# EasyEDA Pro project ProPrj_AI台灯_模块版_2026-09-22.epro, board PCB1
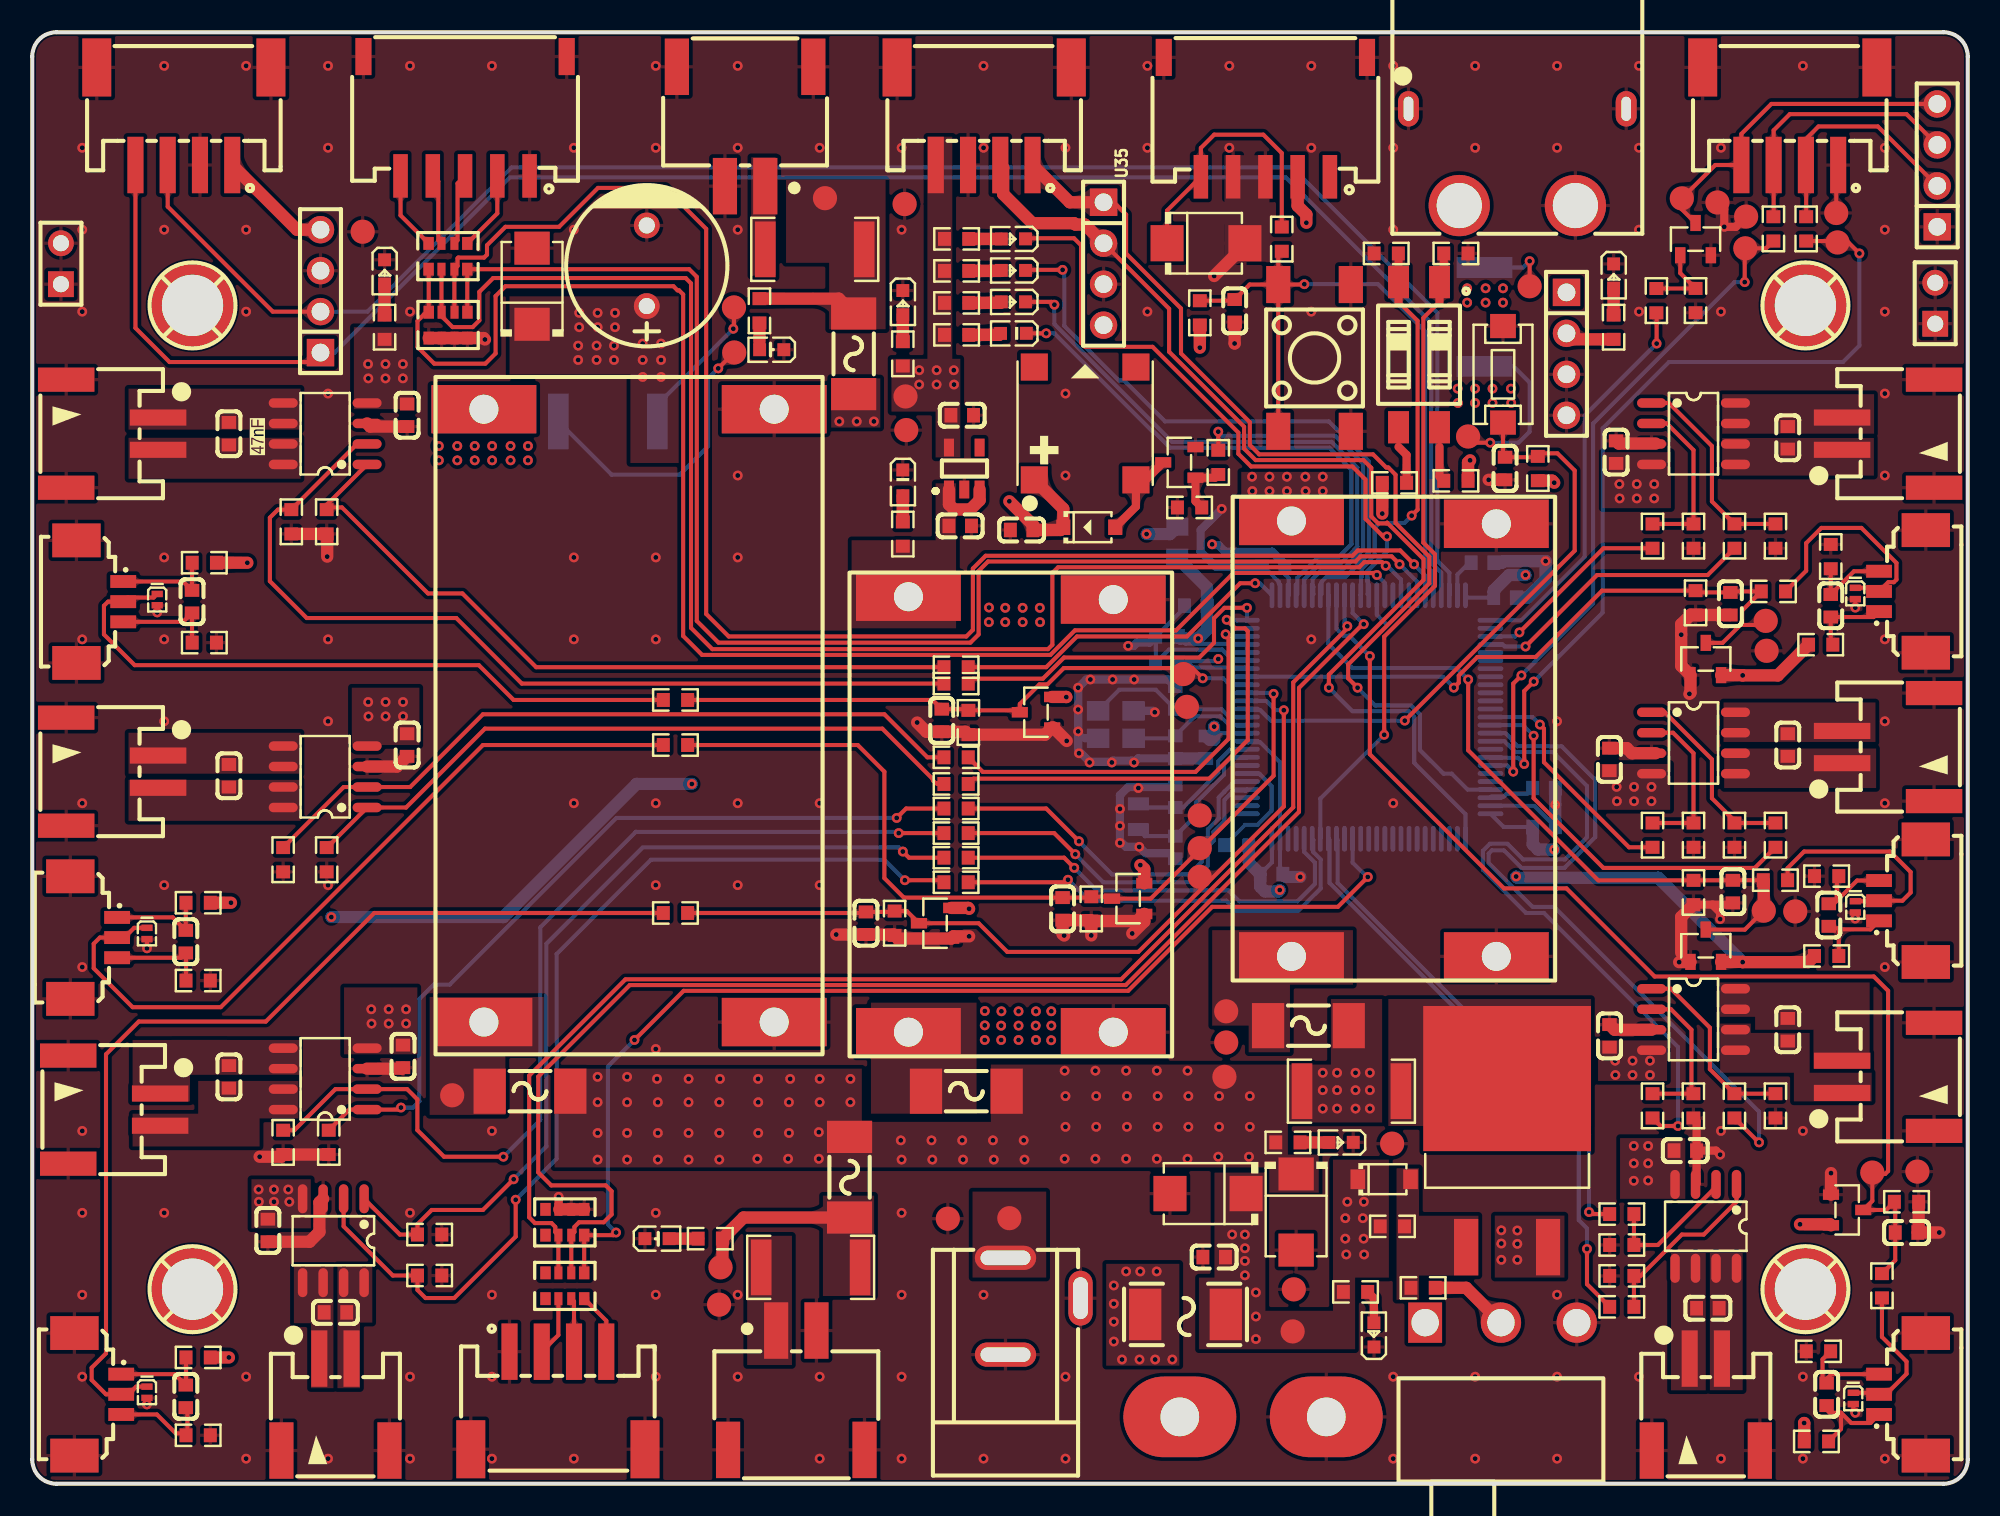
[diagram p5: board, top side]
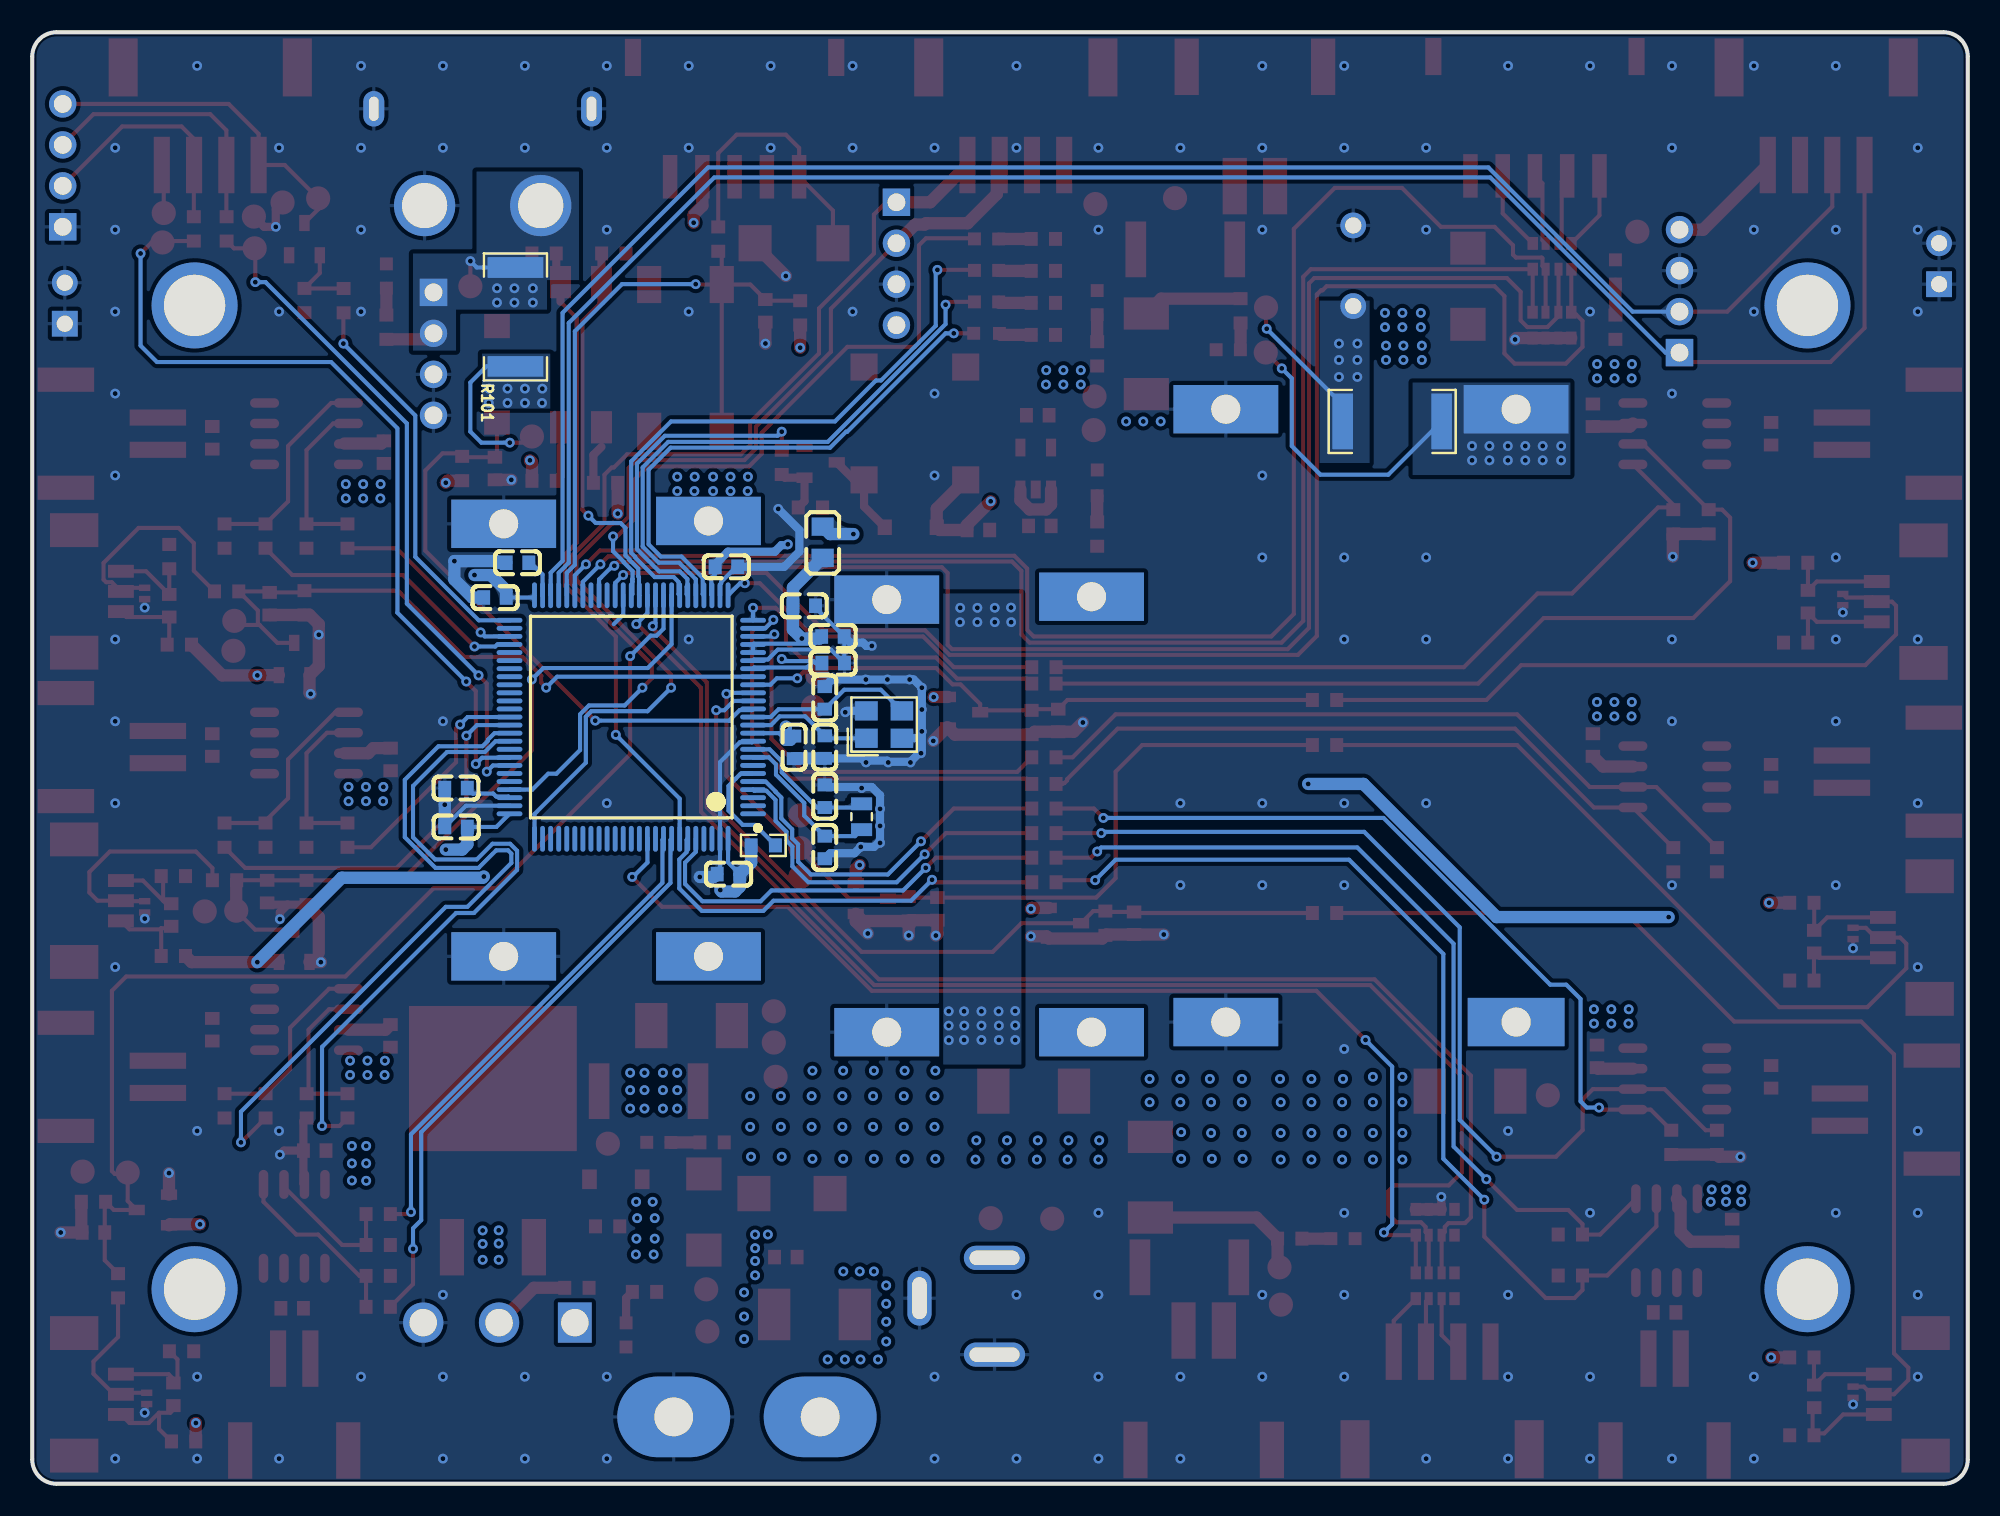
[diagram p6: board, bottom side, seen from below]

Outline 120 x 90 mm; copper layers: Top Layer, GND, VCC, Bottom Layer. Coordinates in mm from the lower left corner of the outline.
Outline path: 0,88.5 0,1.5 arc(0.44,0.44) 1.5,0 118.5,0 arc(119.56,0.44) 120,1.5 120,88.5 arc(119.56,89.56) 118.5,90 1.5,90 arc(0.44,89.56) 0,88.5
Stack: Top Layer 0.035mm Outer layer thickness 1oz / Dielectric1 0.2104mm 7628 RC49% 8.6mil / GND 0.0152mm Inner layer thickness / Dielectric2 1.065mm 1.1mm H/HOZ Copper / VCC 0.0152mm Inner layer thickness / Dielectric3 0.2104mm 7628 RC49% 8.6mil / Bottom Layer 0.035mm Outer layer thickness 1oz

## Design rules (mm)
spacing copperThickness1oz (default): track to track 0.102, other pairs 0.152 to 0.3
spacing copperThickness2oz: track to track 0.203, other pairs 0.152 to 0.3
track width copperThickness1oz (default): min 0.127, default 0.254, max 2.54
track width copperThickness2oz: min 0.203, default 0.254, max 2.54
differential pair differentialPair (default): width min 0.127, default 0.254, max 2.54; gap min 0.152, default 0.152
net 12V_MOTOR uses copperRegion
net GND uses copperRegion

## Placement (name value [footprint] x y rotation side)
BOOT1  DSIC02LS-P  [SW-SMD_4P-L5.1-W6.1-P2.54-LS9.8]  85.98 70.01 180 top
BUZZER1  2.7kHz  [BUZ-SMD_4P-L7.5-W7.5-P7.59-TL]  65.28 65.74 90 top
C1  470uF  [CAP-TH_BD10.0-P5.00-D1.0-FD-H16.0]  38.1 75.52 90 top
C2  100nF  [C0603]  61.34 59.14 0 top
C3  15pF  [C0603]  70.87 39.45 90 bottom
C4  15pF  [C0603]  70.87 42.63 270 bottom
C5  100nF  [C0603]  76.96 56.85 180 bottom
C6  100nF  [C0603]  70.34 50.88 180 bottom
C7  100nF  [C0603]  72.77 45.66 270 bottom
C8  100nF  [C0603]  76.84 37.8 0 bottom
C9  100nF  [C0603]  91.31 54.95 0 bottom
C10  100nF  [C0603]  93.73 40.72 0 bottom
C11  100nF  [C0603]  70.36 52.53 0 bottom
C12  1uF  [C0603]  72.14 54.44 0 bottom
C13  2.2uF  [C0603]  89.92 57.11 180 bottom
C14  2.2uF  [C0603]  93.73 43.14 180 bottom
C15  100nF  [C0603]  91.31 62.95 270 top
C16  15pF  [C0603]  70.87 48.72 270 bottom
C17  100nF  [C0603]  73.28 14.05 0 top
C19  15pF  [C0603]  70.87 45.68 90 bottom
C20  100nF  [C0603]  23.24 66.25 90 top
C21  100nF  [C0603]  9.91 54.69 90 top
C22  100nF  [C0603]  56.39 47.33 90 top
C23  100nF  [C0603]  23.24 45.8 90 top
C24  100nF  [C0603]  9.52 33.61 90 top
C25  100nF  [C0603]  63.88 35.64 90 top
C26  47nF  [C0603]  12.19 65.11 270 top
C27  100nF  [C0603]  74.55 72.73 90 top
C28  47nF  [C0603]  12.19 43.9 90 top
C29  100nF  [C0603]  98.2 63.97 270 top
C30  47nF  [C0603]  108.84 64.85 90 top
C31  100nF  [C0603]  97.78 44.91 270 top
C32  47nF  [C0603]  108.84 45.8 90 top
C33  100nF  [C0603]  22.99 26.5 90 top
C34  47nF  [C0603]  12.19 25.23 270 top
C35  100nF  [C0603]  97.79 27.77 270 top
C36  47nF  [C0603]  108.84 28.15 90 top
C37  100nF  [C0603]  102.49 20.66 180 top
C38  47nF  [C0603]  103.89 10.88 0 top
C39  100nF  [C0603]  14.61 15.71 90 top
C40  47nF  [C0603]  18.8 10.62 0 top
C41  100nF  [C0603]  9.52 5.42 90 top
C42  100nF  [C0603]  51.69 34.75 90 top
C43  100nF  [C0603]  111.51 54.44 270 top
C44  100nF  [C0603]  105.28 54.57 90 top
C45  100nF  [C0603]  111.38 35.26 270 top
C46  100nF  [C0603]  105.44 36.72 90 top
C47  100nF  [C0603]  111.25 5.54 270 top
C48  100nF  [C0603]  116.21 15.58 180 top
C53  1uF  [C0603]  57.53 59.39 180 top
C54  1uF  [C0603]  57.66 66.25 180 top
CN1  PH2.0mm-2P-WT  [CONN-SMD_2P-P2.00_PH2.0-2PWT]  115.06 25.23 90 top
CN2  PH2.0mm-2P-WT  [CONN-SMD_2P-P2.00_PH2.0-2PWT]  4.95 44.15 270 top
CN3  PH2.0mm-2P-WT  [CONN-SMD_2P-P2.00_PH2.0-2PWT]  5.08 23.2 270 top
CN4  PH2.0mm-2P-WT  [CONN-SMD_2P-P2.00_PH2.0-2PWT]  103.76 4.91 0 top
CN7  AFC20-S05ACC-00  [CONN-SMD_AFC20-S05ACC-00]  26.83 84.79 0 top
CN9  PH2.0mm-2P-WT  [CONN-SMD_2P-P2.00_PH2.0-2PWT]  4.95 65.11 270 top
CN10  PH2.0mm-2P-WT  [CONN-SMD_2P-P2.00_PH2.0-2PWT]  115.06 65.11 90 top
CN11  PH2.0mm-2P-WT  [CONN-SMD_2P-P2.00_PH2.0-2PWT]  115.06 45.68 90 top
CN12  PH2.0mm-2P-WT  [CONN-SMD_2P-P2.00_PH2.0-2PWT]  18.8 4.91 0 top
CN15  AFC20-S05ACC-00  [CONN-SMD_AFC20-S05ACC-00]  76.45 84.74 0 top
D1  SMBJ28A  [SMB_L4.6-W3.6-LS5.3-RD]  72.9 17.99 180 top
D6  BZT52C12  [SOD-123_L2.7-W1.6-LS3.7-RD]  83.82 18.88 0 top
D7  SMBJ28A  [SMB_L4.6-W3.6-LS5.3-RD]  78.36 16.85 270 top
D12  BAT54S  [SOT-23-3_L2.9-W1.3-P1.90-LS2.4-BR]  67.94 36.28 0 top
D13  BAT54S  [SOT-23-3_L2.9-W1.3-P1.90-LS2.4-BR]  62.23 47.84 0 top
D14  SMBJ15A  [SMB_L4.6-W3.6-LS5.3-RD]  30.99 74.25 90 top
D15  BAT54S  [SOT-23-3_L2.9-W1.3-P1.90-LS2.4-BR]  55.97 34.75 0 top
D16  BAT54S  [SOT-23-3_L2.9-W1.3-P1.90-LS2.4-BR]  103.76 33.36 270 top
D17  BAT54S  [SOT-23-3_L2.9-W1.3-P1.90-LS2.4-BR]  103.76 51.14 270 top
D18  BAT54S  [SOT-23-3_L2.9-W1.3-P1.90-LS2.4-BR]  112.52 16.97 180 top
D19  SMBJ5.0A  [SMB_L4.6-W3.6-LS5.4-RD]  72.77 76.92 0 top
D20  1N4148W  [SOD-123_L2.7-W1.6-LS3.7-FD]  65.53 59.31 180 top
D21  PESD3V3U1UL  [SOD-882_L1.0-W0.6-RD]  7.11 34.12 270 top
D22  PESD3V3U1UL  [SOD-882_L1.0-W0.6-RD]  7.75 54.82 270 top
D23  PESD3V3U1UL  [SOD-882_L1.0-W0.6-RD]  7.11 5.67 270 top
D24  PESD3V3U1UL  [SOD-882_L1.0-W0.6-RD]  112.9 5.29 270 top
D25  PESD3V3U1UL  [SOD-882_L1.0-W0.6-RD]  113.03 35.77 270 top
D26  PESD3V3U1UL  [SOD-882_L1.0-W0.6-RD]  113.03 55.2 270 top
DC1  DC-005-A200  [DC-IN-TH_DC-005-A200]  62.67 11.01 90 top
F5  AF2-6.30V125TM  [FUSE-SMD_L6.1-W2.5-1]  50.93 70.06 90 top
F6  AF2-6.30V125TM  [FUSE-SMD_L6.1-W2.5-1]  50.67 19.01 270 top
F7  AF2-6.30V125TM  [FUSE-SMD_L6.1-W2.5-1]  79.12 28.41 180 top
F8  AF2-6.30V125TM  [FUSE-SMD_L6.1-W2.5-1]  30.86 24.34 180 top
F9  AF2-6.30V125TM  [FUSE-SMD_L6.1-W2.5-1]  57.91 24.34 180 top
H1  LAIL-PZ2.54-2P-L  [CONN-TH_LAIL-PZ2.54-2P-L]  1.78 75.65 90 top
H2  LAIL-PZ2.54-2P-L  [CONN-TH_LAIL-PZ2.54-2P-L]  117.98 73.2 90 top
L1  CBW201209U601T  [L0805]  70.99 58.38 90 bottom
LED1  XL-1608SURC-06  [LED0603-RD_RED]  60.83 77.19 180 top
LED2  LTST-C190KSKT  [LED0603-RD]  60.83 75.23 180 top
LED3  NCD0603Y2  [LED0603-RD]  60.83 73.28 180 top
LED7  XL-1608SURC-06  [LED0603-RD_RED]  81.15 21.17 180 top
LED8  GL0603UW01  [LED0603-R-RD]  45.85 70.31 180 top
LED9  GL0603UW01  [LED0603-R-RD]  38.74 15.2 0 top
LED10  LTST-C190KSKT  [LED0603-RD]  21.84 75.14 270 top
LED11  NCD0603Y2  [LED0603-RD]  98.04 74.89 270 top
LED12  LTST-C190KSKT  [LED0603-RD]  53.97 73.24 270 top
LED13  XL-1608SURC-06  [LED0603-RD_RED]  83.19 9.23 90 top
Q2  SQM120P06-07L_GE3  [TO-263-2_L10.1-W9.1-P5.08-LS15.2-TL-1]  91.44 19.9 90 top
Q10  2N7002  [SOT-23-3_L2.9-W1.3-P1.90-LS2.4-BR]  103.12 77.17 270 top
Q11  SS8050  [SOT-23-3_L2.9-W1.3-P1.90-LS2.4-BR]  71.12 63.33 0 top
R12  100kΩ  [R0603]  84.33 15.96 0 top
R13  10kΩ  [R0603]  86.23 12.15 0 top
R19  100R  [R0603]  84.46 62.06 180 top
R20  100R  [R0603]  88.26 62.19 0 top
R21  10K  [R0603]  83.95 76.28 0 top
R22  10K  [R0603]  88.26 76.28 180 top
R23  10K  [R0603]  93.34 62.95 90 top
R24  0Ω  [R0603]  74.68 39.58 180 bottom
R25  100Ω  [R0603]  57.28 50.63 180 top
R26  10kΩ  [R0603]  18.25 59.65 270 top
R27  100Ω  [R0603]  57.28 49.61 180 top
R28  10kΩ  [R0603]  16.06 59.65 270 top
R29  1kΩ  [R0603]  10.67 57.11 0 top
R30  1kΩ  [R0603]  10.67 52.15 180 top
R31  1kΩ  [R0603]  39.88 48.6 180 top
R32  100kΩ  [R0603]  58.04 47.2 90 top
R33  100Ω  [R0603]  57.28 45.04 180 top
R34  10kΩ  [R0603]  15.55 38.69 270 top
R35  100Ω  [R0603]  57.28 43.39 180 top
R36  10kΩ  [R0603]  18.25 38.69 270 top
R37  1kΩ  [R0603]  10.29 36.03 0 top
R38  1kΩ  [R0603]  10.29 31.2 180 top
R39  1kΩ  [R0603]  39.88 45.8 180 top
R40  100kΩ  [R0603]  65.66 35.64 90 top
R41  100Ω  [R0603]  100.7 73.36 90 top
R42  100kΩ  [R0603]  103.12 73.36 90 top
R43  10kΩ  [R0603]  72.39 72.6 270 top
R44  12kΩ  [R0603]  77.85 21.17 0 top
R45  12kΩ  [R0603]  45.09 72.73 270 top
R46  12kΩ  [R0603]  42.04 15.2 180 top
R47  5.1kΩ  [R0603]  21.84 71.71 90 top
R48  100Ω  [R0603]  100.46 58.76 90 top
R49  10kΩ  [R0603]  103 58.76 270 top
R50  100Ω  [R0603]  105.54 58.76 90 top
R51  10kΩ  [R0603]  108.08 58.76 270 top
R52  100Ω  [R0603]  100.46 40.22 90 top
R53  10kΩ  [R0603]  103 40.22 270 top
R54  100Ω  [R0603]  108.08 40.22 90 top
R55  10kΩ  [R0603]  105.54 40.22 270 top
R56  100Ω  [R0603]  57.28 41.87 180 top
R57  10kΩ  [R0603]  18.38 21.17 270 top
R58  100Ω  [R0603]  57.28 40.34 180 top
R59  10kΩ  [R0603]  15.55 21.17 270 top
R60  100Ω  [R0603]  100.46 23.43 90 top
R61  10kΩ  [R0603]  102.99 23.43 270 top
R62  100Ω  [R0603]  105.53 23.43 90 top
R63  10kΩ  [R0603]  108.08 23.43 270 top
R64  100Ω  [R0603]  98.55 16.72 0 top
R65  10kΩ  [R0603]  98.55 14.8 180 top
R66  100Ω  [R0603]  98.55 10.97 0 top
R67  10kΩ  [R0603]  98.55 12.89 180 top
R68  100Ω  [R0603]  57.28 37.3 180 top
R69  10kΩ  [R0603]  24.64 12.91 0 top
R70  100Ω  [R0603]  57.28 38.82 180 top
R71  10kΩ  [R0603]  24.64 15.45 0 top
R72  1kΩ  [R0603]  10.29 7.83 0 top
R73  1kΩ  [R0603]  10.29 3 180 top
R74  1kΩ  [R0603]  39.88 35.39 180 top
R75  100kΩ  [R0603]  53.47 34.75 90 top
R76  1kΩ  [R0603]  110.88 52.03 180 top
R77  1kΩ  [R0603]  111.51 57.49 270 top
R78  1kΩ  [R0603]  107.95 55.33 0 top
R79  100kΩ  [R0603]  103.12 54.62 90 top
R80  1kΩ  [R0603]  111.25 32.72 180 top
R81  1kΩ  [R0603]  111.25 37.68 0 top
R82  1kΩ  [R0603]  108.08 37.42 0 top
R83  100kΩ  [R0603]  103 36.66 90 top
R84  1kΩ  [R0603]  110.62 2.62 180 top
R85  1kΩ  [R0603]  110.74 8.21 0 top
R86  1kΩ  [R0603]  114.68 12.28 270 top
R87  100kΩ  [R0603]  116.21 17.48 180 top
R88  4.7kΩ  [R0603]  98.04 71.71 90 top
R89  1.5kΩ  [R0603]  53.97 58.89 90 top
R90  1kΩ  [R0603]  53.97 70.06 90 top
R91  12kΩ  [R0603]  82.04 11.9 0 top
R92  1kΩ  [R0603]  77.47 77.17 270 top
R93  47Ω  [R0603]  109.98 77.81 90 top
R94  47Ω  [R0603]  107.95 77.81 90 top
R95  1kΩ  [R0603]  57.31 77.19 0 top
R96  1kΩ  [R0603]  57.31 75.2 0 top
R97  1kΩ  [R0603]  57.31 73.22 0 top
R98  1kΩ  [R0603]  57.31 71.24 0 top
R99  470Ω  [R0603]  73.53 63.33 270 top
R100  100kΩ  [R0603]  71.75 60.54 0 top
R101  10mΩ  [R2512]  90.04 72.35 90 bottom
R102  10mΩ  [R2512]  35.69 65.87 0 bottom
R103  5mΩ  [R2512]  81.79 24.34 180 top
R104  10mΩ  [R2512]  48.51 76.54 180 top
R105  10mΩ  [R2512]  48.26 13.42 180 top
RN1  100Ω  [RES-ARRAY-SMD_0603-8P-L3.2-W1.6-BL]  25.77 76.11 0 top
RN2  100Ω  [RES-ARRAY-SMD_0603-8P-L3.2-W1.6-BL]  33.02 12.28 180 top
RN3  10kΩ  [RES-ARRAY-SMD_0603-8P-L3.2-W1.6-BL]  25.78 71.84 0 top
RN4  10kΩ  [RES-ARRAY-SMD_0603-8P-L3.2-W1.6-BL]  33.02 16.21 180 top
RST1  EVQPE104K  [SW-SMD_L6.0-W3.5-LS7.2]  91.19 68.79 90 top
SW1  KH-6X6X5H-STM  [SW-SMD_4P-L6.0-W6.0-P4.50-LS9.0_H5.0]  79.5 69.81 90 top
TP1  -  [M3螺丝]  10 12 0 top
TP2  -  [M3螺丝]  110 12 0 top
TP3  -  [M3螺丝]  10 73 0 top
TP4  -  [M3螺丝]  110 73 0 top
TP5  -  [Test-Point-0.5mm]  60.58 16.47 0 top
TP6  -  [Test-Point-0.5mm]  78.14 9.44 0 top
TP7  -  [Test-Point-0.5mm]  73.91 25.23 0 top
TP8  -  [Test-Point-0.5mm]  49.15 79.71 0 top
TP9  -  [Test-Point-0.5mm]  42.67 13.42 0 top
TP10  -  [Test-Point-0.5mm]  26.03 24.09 0 top
TP11  -  [Test-Point-0.5mm]  89.02 64.94 0 top
TP12  -  [Test-Point-0.5mm]  74.03 29.29 0 top
TP13  -  [Test-Point-0.5mm]  92.84 74.25 0 top
TP14  -  [Test-Point-0.5mm]  43.52 70.14 0 top
TP15  -  [Test-Point-0.5mm]  54.14 67.42 0 top
TP16  -  [Test-Point-0.5mm]  42.58 11.1 0 top
TP17  -  [Test-Point-0.5mm]  20.49 77.63 0 top
TP18  -  [Test-Point-0.5mm]  43.51 72.94 0 top
TP20  -  [Test-Point-0.5mm]  54.09 79.35 0 top
TP21  -  [Test-Point-0.5mm]  78.22 12.05 0 top
TP22  -  [Test-Point-0.5mm]  84.31 21.09 0 top
TP23  -  [Test-Point-0.5mm]  74.03 27.36 0 top
TP24  -  [Test-Point-0.5mm]  71.37 50.2 0 top
TP25  -  [Test-Point-0.5mm]  72.38 39.41 0 top
TP26  -  [Test-Point-0.5mm]  72.38 37.63 0 top
TP27  -  [Test-Point-0.5mm]  107.47 53.5 0 top
TP28  -  [Test-Point-0.5mm]  107.35 35.53 0 top
TP29  -  [Test-Point-0.5mm]  114.09 19.29 0 top
TP30  -  [Test-Point-0.5mm]  111.93 76.97 0 top
TP31  -  [Test-Point-0.5mm]  106.21 76.6 0 top
TP32  -  [Test-Point-0.5mm]  102.27 79.7 0 top
TP33  -  [Test-Point-0.5mm]  54.19 65.33 0 top
TP35  -  [Test-Point-0.5mm]  72.38 41.44 0 top
TP36  -  [Test-Point-0.5mm]  109.31 35.49 0 top
TP38  -  [Test-Point-0.5mm]  107.53 51.65 0 top
TP39  -  [Test-Point-0.5mm]  71.59 48.17 0 top
TP40  -  [Test-Point-0.5mm]  111.85 78.79 0 top
TP41  -  [Test-Point-0.5mm]  104.48 79.44 0 top
TP42  -  [Test-Point-0.5mm]  106.26 78.57 0 top
TP43  -  [Test-Point-0.5mm]  116.88 19.35 0 top
TP44  -  [Test-Point-0.5mm]  56.76 16.43 0 top
U1  SS-12D06-G050  [SW-TH_3P-P4.70_SS-12D06-G050]  91.06 9.99 0 top
U2  AF2-15.0V065TM  [F2410]  71.5 10.5 0 top
U3  PSC-1608U52GC-G4  [LED0603-RD_GREEN]  53.97 62.06 270 top
U4  PSC-1608U52GC-G4  [LED0603-RD_GREEN]  60.83 71.33 180 top
U5  A2001WR-S-04PD01  [CONN-SMD_A2001WR-S-04PD01]  108.97 84.79 0 top
U6  XT60PW-F  [TH_2P-XT60PW-F]  92.07 82.25 0 top
U7  STM32F407VGT6  [LQFP-100_L14.0-W14.0-P0.50-LS16.0-BL]  82.86 47.54 90 bottom
U8  RZ7899-MS  [SOIC-8_L4.9-W3.9-P1.27-LS6.0-BL]  18.16 65.11 90 top
U9  RZ7899-MS  [SOIC-8_L4.9-W3.9-P1.27-LS6.0-BL]  18.16 43.84 90 top
U10  A2001WR-S-04PD01  [CONN-SMD_A2001WR-S-04PD01]  59.02 84.79 0 top
U11  -  [电源焊盘封装]  71.15 4.15 0 top
U12  -  [电源焊盘封装]  80.23 4.15 0 top
U13  RZ7899-MS  [SOIC-8_L4.9-W3.9-P1.27-LS6.0-BL]  103 65.11 270 top
U14  RZ7899-MS  [SOIC-8_L4.9-W3.9-P1.27-LS6.0-BL]  103 45.93 270 top
U15  RZ7899-MS  [SOIC-8_L4.9-W3.9-P1.27-LS6.0-BL]  18.16 25.1 90 top
U16  RZ7899-MS  [SOIC-8_L4.9-W3.9-P1.27-LS6.0-BL]  103 28.79 270 top
U17  RZ7899-MS  [SOIC-8_L4.9-W3.9-P1.27-LS6.0-BL]  103.76 15.96 180 top
U18  RZ7899-MS  [SOIC-8_L4.9-W3.9-P1.27-LS6.0-BL]  18.67 15.07 180 top
U19  -  [24V降压模块封装]  74.42 31.2 90 top
U20  -  [24V降压模块封装]  50.67 26.5 90 top
U21  -  [大功率24V降压模块封装]  25 26.63 90 top
U22  XDWF-0125WT-03P  [CONN-SMD_3P-P1.25_XDWF-0125WT-03P]  4.19 54.69 270 top
U23  AP2112K-3.3TRG1  [SOT-25-5_L2.9-W1.6-P0.95-LS2.8-BL]  57.78 62.95 0 top
U24  XDWF-0125WT-03P  [CONN-SMD_3P-P1.25_XDWF-0125WT-03P]  3.81 33.87 270 top
U25  XDWF-0125WT-03P  [CONN-SMD_3P-P1.25_XDWF-0125WT-03P]  4.06 5.54 270 top
U26  XDWF-0125WT-03P  [CONN-SMD_3P-P1.25_XDWF-0125WT-03P]  115.95 55.33 90 top
U27  XDWF-0125WT-03P  [CONN-SMD_3P-P1.25_XDWF-0125WT-03P]  115.95 36.15 90 top
U28  XDWF-0125WT-03P  [CONN-SMD_3P-P1.25_XDWF-0125WT-03P]  115.95 5.54 90 top
U29  A2001WR-S-04PD01  [CONN-SMD_A2001WR-S-04PD01]  32.59 5.16 180 top
U30  A2001WR-S-04PD01  [CONN-SMD_A2001WR-S-04PD01]  9.4 84.79 0 top
U31  BX-XH2.54-2PWT  [CONN-SMD_2P-P2.50_BX-XH2.54-2PWT]  44.2 84.16 180 top
U32  BX-XH2.54-2PWT  [CONN-SMD_2P-P2.50_BX-XH2.54-2PWT]  47.37 5.8 0 top
U33  HX PZ2.54-1x4P ZZ  [HDR-TH_4P-P2.54-V-M]  17.87 73.95 90 top
U34  HX PZ2.54-1x4P ZZ  [HDR-TH_4P-P2.54-V-M]  95.12 70.06 270 top
U35  HX PZ2.54-1x4P ZZ  [HDR-TH_4P-P2.54-V-M]  66.42 75.65 270 top
U36  HX PZ2.54-1x4P ZZ  [HDR-TH_4P-P2.54-V-M]  118.11 81.75 90 top
X1  32.768kHz  [CRYSTAL-SMD_2P-L2.0-W1.2]  68.58 41.36 90 bottom
X2  8MHz  [CRYSTAL-SMD_4P-L3.2-W2.5-BL]  67.18 47.07 180 bottom

## Footprints (pads in the part's own frame, mm; a bottom-side part is the same pattern mirrored in y, then rotated)
24V降压模块封装
  rect 3x6.5 hole 1.8: 1(1.5,-3.65) 2(1.5,-16.35) 3(28.5,-3.65) 4(28.321,-16.35)
BUZ-SMD_4P-L7.5-W7.5-P7.59-TL
  rect 1.681x1.68 smd: 1(-3.498,3.15) 2(-3.498,-3.15) 3(3.498,-3.15) 4(3.498,3.15)
C0603
  rect 0.8x0.9 smd: 1(-0.7,0) 2(0.7,0)
CAP-TH_BD10.0-P5.00-D1.0-FD-H16.0
  round 1.6 hole 1: 1(-2.5,0) 2(2.5,0)
CONN-SMD_2P-P2.00_PH2.0-2PWT
  rect 1x3.5 smd: 1(-1,2.85) 2(1,2.85)
  rect 1.5x3.5 smd: 3(3.35,-2.85) 4(-3.35,-2.85)
CONN-SMD_2P-P2.50_BX-XH2.54-2PWT
  rect 1.5x3.5 smd: 1(-1.25,3.7) 2(1.25,3.7) 3(4.23,-3.7) 4(-4.23,-3.7)
CONN-SMD_3P-P1.25_XDWF-0125WT-03P
  rect 0.8x1.6 smd: 1(-1.25,1.45) 2(0,1.45) 3(1.25,1.45)
  rect 2.1x3 smd: 4(3.8,-1.45) 5(-3.8,-1.45)
CONN-SMD_A2001WR-S-04PD01
  rect 1x3.5 smd: 1(3,-3.026) 2(1,-3.024) 3(-1,-3.024) 4(-3,-3.024)
  rect 1.8x3.6 smd: 5(-5.4,3.026) 6(5.4,3.026)
CONN-SMD_AFC20-S05ACC-00
  rect 0.9x2.7 smd: 1(4,-3.7) 2(2,-3.7) 3(0,-3.7) 4(-2,-3.7) 5(-4,-3.7)
  rect 1x2.3 smd: 6(-6.3,3.7) 7(6.3,3.7)
CONN-TH_LAIL-PZ2.54-2P-L
  rect 1.6x1.6 hole 1: 1(-1.27,0)
  round 1.6 hole 1: 2(1.27,0)
CRYSTAL-SMD_2P-L2.0-W1.2
  rect 0.8x1.3 smd: 1(-0.8,0) 2(0.8,0)
CRYSTAL-SMD_4P-L3.2-W2.5-BL
  rect 1.4x1.2 smd: 1(-1.1,-0.85) 2(1.1,-0.85) 3(1.1,0.85) 4(-1.1,0.85)
DC-IN-TH_DC-005-A200
  oval 1.5x3.8 hole 0.9x3.1: 1(3,2.325) 2(-3,2.325)
  oval 3.4x1.5 hole 2.6x0.9: 3(0.5,-2.325)
F2410
  rect 2x3.2 smd: 1(-2.5,0) 2(2.5,0)
FUSE-SMD_L6.1-W2.5-1
  rect 2x2.8 smd: 1(-2.5,0) 2(2.5,0)
HDR-TH_4P-P2.54-V-M
  rect 1.7x1.7 hole 1.1: 1(-3.81,0)
  round 1.7 hole 1.1: 2(-1.27,0) 3(1.27,0) 4(3.81,0)
L0805
  rect 1.133x1.377 smd: 1(-0.966,0) 2(0.966,0)
LED0603-R-RD
  rect 0.8x0.8 smd: 1(0.751,0) 2(-0.751,0)
LED0603-RD
  rect 0.8x0.8 smd: 1(-0.749,0) 2(0.749,0)
LED0603-RD_GREEN
  rect 0.8x0.8 smd: 1(-0.799,-0.004) 2(0.799,0.004)
LED0603-RD_RED
  rect 0.8x0.8 smd: 1(-0.749,-0.004) 2(0.749,0.004)
LQFP-100_L14.0-W14.0-P0.50-LS16.0-BL
  oval 0.3x1.6 smd: 1(-6,-7.55) 2(-5.5,-7.55) 3(-5,-7.55) 4(-4.5,-7.55) 5(-4,-7.55) 6(-3.5,-7.55) 7(-3,-7.55) 8(-2.5,-7.55) 9(-2,-7.55) 10(-1.5,-7.55) 11(-1,-7.55) 12(-0.5,-7.55) 13(0,-7.55) 14(0.5,-7.55) 15(1,-7.55) 16(1.5,-7.55) 17(2,-7.55) 18(2.5,-7.55) 19(3,-7.55) 20(3.5,-7.55) 21(4,-7.55) 22(4.5,-7.55) 23(5,-7.55) 24(5.5,-7.55) 25(6,-7.55) 51(6,7.55) 52(5.5,7.55) 53(5,7.55) 54(4.5,7.55) 55(4,7.55) 56(3.5,7.55) 57(3,7.55) 58(2.5,7.55) 59(2,7.55) 60(1.5,7.55) 61(1,7.55) 62(0.5,7.55) 63(0,7.55) 64(-0.5,7.55) 65(-1,7.55) 66(-1.5,7.55) 67(-2,7.55) 68(-2.5,7.55) 69(-3,7.55) 70(-3.5,7.55) 71(-4,7.55) 72(-4.5,7.55) 73(-5,7.55) 74(-5.5,7.55) 75(-6,7.55)
  oval 1.6x0.3 smd: 26(7.55,-6) 27(7.55,-5.5) 28(7.55,-5) 29(7.55,-4.5) 30(7.55,-4) 31(7.55,-3.5) 32(7.55,-3) 33(7.55,-2.5) 34(7.55,-2) 35(7.55,-1.5) 36(7.55,-1) 37(7.55,-0.5) 38(7.55,0) 39(7.55,0.5) 40(7.55,1) 41(7.55,1.5) 42(7.55,2) 43(7.55,2.5) 44(7.55,3) 45(7.55,3.5) 46(7.55,4) 47(7.55,4.5) 48(7.55,5) 49(7.55,5.5) 50(7.55,6) 76(-7.55,6) 77(-7.55,5.5) 78(-7.55,5) 79(-7.55,4.5) 80(-7.55,4) 81(-7.55,3.5) 82(-7.55,3) 83(-7.55,2.5) 84(-7.55,2) 85(-7.55,1.5) 86(-7.55,1) 87(-7.55,0.5) 88(-7.55,0) 89(-7.55,-0.5) 90(-7.55,-1) 91(-7.55,-1.5) 92(-7.55,-2) 93(-7.55,-2.5) 94(-7.55,-3) 95(-7.55,-3.5) 96(-7.55,-4) 97(-7.55,-4.5) 98(-7.55,-5) 99(-7.55,-5.5) 100(-7.55,-6)
M3螺丝
  round 5.334 hole 3.8: 1(-0.064,0.064)
R0603
  rect 0.806x0.864 smd: 1(-0.753,0) 2(0.753,0)
R2512
  rect 1.282x3.456 smd: 1(-3.067,0) 2(3.067,0)
RES-ARRAY-SMD_0603-8P-L3.2-W1.6-BL
  rect 0.65x0.8 smd: 1(-1.2,-0.8) 4(1.2,-0.8) 5(1.2,0.8) 8(-1.2,0.8)
  rect 0.5x0.8 smd: 2(-0.4,-0.8) 3(0.4,-0.8) 6(0.4,0.8) 7(-0.4,0.8)
SMB_L4.6-W3.6-LS5.3-RD
  rect 2.047x2.192 smd: 1(-2.361,0) 2(2.361,0)
SMB_L4.6-W3.6-LS5.4-RD
  rect 2.047x2.241 smd: 1(-2.413,0) 2(2.413,0)
SOD-123_L2.7-W1.6-LS3.7-FD
  rect 0.88x0.96 smd: 1(-1.61,0) 2(1.61,0)
SOD-123_L2.7-W1.6-LS3.7-RD
  rect 0.91x1.22 smd: 1(-1.635,0) 2(1.635,0)
SOD-882_L1.0-W0.6-RD
  rect 0.4x0.7 smd: 1(-0.35,0) 2(0.35,0)
SOIC-8_L4.9-W3.9-P1.27-LS6.0-BL
  oval 0.588x1.8 smd: 1(-1.905,-2.6) 2(-0.635,-2.6) 3(0.635,-2.6) 4(1.905,-2.6) 5(1.905,2.6) 6(0.635,2.6) 7(-0.635,2.6) 8(-1.905,2.6)
SOT-23-3_L2.9-W1.3-P1.90-LS2.4-BR
  rect 1x0.65 smd: 1(1,-0.95) 2(1,0.95) 3(-1,0)
SOT-25-5_L2.9-W1.6-P0.95-LS2.8-BL
  rect 0.623x1.105 smd: 1(-0.95,-1.3) 2(-0.001,-1.3) 3(0.95,-1.3) 4(0.95,1.3) 5(-0.95,1.3)
SW-SMD_4P-L5.1-W6.1-P2.54-LS9.8
  rect 1.3x2 smd: 1(-1.27,-4.5) 2(1.27,-4.5) 3(1.27,4.5) 4(-1.27,4.5)
SW-SMD_4P-L6.0-W6.0-P4.50-LS9.0_H5.0
  rect 2.3x1.5 smd: 1(-4.55,2.25) 2(4.55,2.25) 3(-4.55,-2.25) 4(4.55,-2.25)
SW-SMD_L6.0-W3.5-LS7.2
  rect 1.5x1.6 smd: 1(-2.993,0) 2(2.993,0)
SW-TH_3P-P4.70_SS-12D06-G050
  rect 2.1x2.5 hole 1.7: 1(-4.7,0)
  round 2.5 hole 1.7: 2(0,0) 3(4.7,0)
Test-Point-0.5mm
  round 1.5 smd: 1(0,0)
TH_2P-XT60PW-F
  oval 1.3x2.2 hole 0.6x1.5: 1(-6.75,3) 2(6.75,3)
  round 3.8 hole 2.8: 3(-3.6,-3) 4(3.6,-3)
TO-263-2_L10.1-W9.1-P5.08-LS15.2-TL-1
  rect 3.5x1.5 smd: 1(-5.228,2.54) 3(-5.228,-2.54)
  rect 9x10.4 smd: 4(5.228,0)
大功率24V降压模块封装
  rect 3x6 hole 1.8: 1(2,-3)
  rect 3x6.5 hole 1.8: 2(2,-21) 3(40,-3) 4(40,-21)
电源焊盘封装
  oval 7x5 hole 2.4: 1(0,0)

## Nets
As in the schematic, except:
GND: C1.2 C2.1 C3.1 C4.1 C5.2 C6.2 C7.2 C8.2 C9.2 C10.2 C11.1 C12.1 C13.1 C14.1 C15.2 C16.1 C17.1 C19.1 C20.1 C22.1 C23.1 C25.1 C27.1 C29.1 C31.1 C33.1 C35.1 C37.1 C39.1 C42.1 C44.1 C46.1 C48.1 C53.1 C54.1 CN1.3 CN1.4 CN2.3 CN2.4 CN3.3 CN3.4 CN4.3 CN4.4 CN7.1 CN7.6 CN7.7 CN9.3 CN9.4 CN10.3 CN10.4 CN11.3 CN11.4 CN12.3 CN12.4 CN15.3 CN15.4 CN15.6 CN15.7 D1.2 D7.2 D12.1 D13.1 D14.2 D15.1 D16.1 D17.1 D18.1 D19.2 D21.2 D22.2 D23.2 D24.2 D25.2 D26.2 DC1.2 DC1.3 H1.1 H1.2 H2.1 H2.2 LED7.1 LED8.2 LED9.2 LED10.1 LED11.1 LED12.1 LED13.1 Q10.2 Q11.2 R21.1 R22.1 R26.2 R28.2 R30.1 R32.1 R34.2 R36.2 R38.1 R40.1 R42.1 R49.2 R51.2 R53.2 R55.2 R57.2 R59.2 R61.2 R63.2 R65.2 R67.2 R69.2 R71.2 R73.1 R75.1 R77.1 R79.1 R81.1 R83.1 R85.1 R87.1 R100.1 RN3.1 RN3.2 RN3.3 RN3.4 RN4.1 RN4.2 RN4.3 RST1.2 SW1.3 SW1.4 TP16.1 TP17.1 TP20.1 TP21.1 TP22.1 TP23.1 TP33.1 TP35.1 TP36.1 TP38.1 TP39.1 TP40.1 TP41.1 TP42.1 TP43.1 TP44.1 U1.3 U3.1 U5.1 U5.5 U5.6 U6.1 U6.2 U6.4 U7.10 U7.20 U7.27 U7.74 U7.99 U8.3 U9.3 U10.3 U10.5 U10.6 U12.1 U13.3 U14.3 U15.3 U16.3 U17.3 U18.3 U19.2 U19.4 U20.2 U20.4 U21.2 U21.4 U22.4 U22.5 U23.2 U24.4 U24.5 U25.4 U25.5 U26.4 U26.5 U27.4 U27.5 U28.4 U28.5 U29.1 U29.5 U29.6 U30.2 U30.5 U30.6 U31.2 U31.3 U31.4 U32.2 U32.3 U32.4 U33.3 U34.3 U34.4 U35.3 U36.1 X2.2 X2.4
VIN_24_RAW: DC1.1 TP5.1 U2.1 U11.1

Pads without a net: BUZZER1 3 4; CN15 1; RN2 4 5; RN4 4 5; TP1 1; TP2 1; TP3 1; TP4 1; U1 1; U23 4

## Via types
v1: diameter 0.61, hole 0.305, Top Layer to Bottom Layer, 518 vias

## Routing (per net, layer and track width the routed paths; a pad name or vN(x,y) marks a point on that pad's centre or on a via; arc(x,y) is an arc through that point)
3V3_MCU: length 240.6
  Top Layer w0.762: v1(89.15,63.46) 89.02,63.33 R20.2 ; R23.1 94.23,62.2 v1(94.36,62.07) ; v1(72.39,70.44) R43.2 ; CN15.2 78.45,79.24 78.99,78.7 v1(78.99,78.19) ; v1(60.58,60.92) 62.04,59.45 C2.2 63.75,59.14 D20.2 63.92,60.45 BUZZER1.1 ; U33.4 16.41,77.76 U30.1 ; R19.2 v1(83.7,60.16)
  VCC w0.762: v1(54.99,69.05) 53.72,70.31 53.72,74.12 48.39,79.46 19.57,79.46 U33.4 ; v1(73.15,58.25) 73.15,51.52 v1(73.53,51.14) 73.53,47.2 v1(73.28,46.95) ; v1(73.15,58.25) 72.52,58.89 v1(69.09,58.89) 62.61,58.89 v1(60.58,60.92) 60.2,61.3 60.2,65.11 v1(57.15,68.16) ; v1(73.15,58.25) 73.55,57.85 73.68,57.49 82.93,57.49 83.29,57.85 86.01,57.85 ; v1(77.34,36.81) 77.37,36.79 93.09,36.79 94.36,38.06 v1(94.36,39.32) 95.73,40.69 95.73,53.19 v1(92.58,56.34) 91.69,57.23 86.9,57.23 86.49,57.65 ; v1(78.99,78.19) 78.99,77.05 v1(72.39,70.44) 67.82,70.44 U35.4 63.63,69.05 v1(57.13,69.05) ; 86.49,57.65 86.29,57.85 86.01,57.85 ; 86.49,57.65 86.49,61.17 88.77,63.46 v1(89.15,63.46) 92.97,63.46 v1(94.36,62.07) ; v1(83.7,60.16) 84.21,60.16 86.01,58.36 86.01,57.85
  Bottom Layer w0.254: C8.1 76.86,38.53 U7.100 ; 71.57,51.01 71.44,50.88 C6.1 ; 71.57,51.01 73.41,51.01 v1(73.53,51.14) ; 71.57,51.01 71.97,50.61 75.24,50.61 U7.19 ; C10.1 91.23,40.72 U7.75 ; C5.1 77.66,56.41 77.9,56.17 77.9,55.13 U7.28 ; 73.28,46.12 73.7,46.54 U7.11 ; C9.1 89,54.95 U7.50
  Bottom Layer w0.508: v1(73.15,58.25) 73.2,58.2 73.56,58.2 73.96,57.79 76.87,57.79 77.66,57 C5.1
  Bottom Layer w0.762: v1(69.09,58.89) 70.53,58.89 70.99,59.34 ; C7.1 73.01,46.12 73.28,46.12 v1(73.28,46.95) ; R24.1 75.43,38.51 C8.1 76.13,37.02 76.43,36.72 77.26,36.72 v1(77.34,36.81) ; C9.1 90.61,55.39 91.57,56.34 v1(92.58,56.34) ; v1(94.36,39.32) 93.35,39.32 93.03,39.65 C10.1
  vias: v1(54.99,68.16) v1(56.07,69.05) v1(56.07,68.16)
5V_SYS: length 3.9
  Top Layer w0.762: U23.3 58.73,60.98 58.16,60.41 57.15,60.41 56.84,60.72 U23.1
12V_LINUX: length 7.6
  Top Layer w0.254: v1(92.84,75.81) TP13.1
  Top Layer w0.762: U34.2 95.5,70.96 R88.1
  Bottom Layer w0.254: R101.2 92.44,75.41 v1(92.84,75.81)
  vias: v1(88.96,74.12) v1(88.96,73.24) v1(90.11,74.12) v1(90.11,73.24) v1(91.19,74.12) v1(91.19,73.24)
12V_MOTOR: length 9
  Top Layer w0.254: TP18.1 43.51,71.66 v1(43.47,71.62)
  Bottom Layer w0.254: v1(43.47,71.62) 38.75,66.9 R102.2
  vias: v1(14.03,18.25) v1(14.05,17.48) v1(14.99,18.25) v1(14.99,17.48) v1(15.88,18.25) v1(15.94,17.48) v1(20.82,69.43) v1(20.84,68.54) v1(20.83,48.47) v1(20.84,47.58) v1(21.02,29.42) v1(21.03,28.53) v1(21.9,69.43) v1(21.9,68.54) v1(21.91,48.47) v1(21.91,47.58) v1(22.1,29.42) v1(22.1,28.53) v1(22.98,69.43) v1(22.98,68.54) v1(22.99,48.47) v1(22.99,47.58) v1(23.18,29.42) v1(23.18,28.53) v1(33.85,70.57) v1(33.85,69.68) v1(33.91,72.6) v1(33.91,71.71) v1(34.99,70.57) v1(34.99,69.68) v1(35.05,72.6) v1(35.05,71.71) v1(36.13,72.6) v1(36.13,71.71) v1(36.07,70.57) v1(36.07,69.68) v1(37.84,70.7) v1(37.85,69.68) v1(37.85,68.63) v1(38.98,70.7) v1(38.99,69.68) v1(38.99,68.63) v1(98.14,26.23) v1(98.23,43.21) v1(98.25,42.32) v1(98.15,25.34) v1(98.4,61.98) v1(98.42,61.09) v1(99.22,26.23) v1(99.22,25.34) v1(99.31,43.21) v1(99.31,42.32) v1(99.29,20.94) v1(99.29,19.87) v1(99.29,18.79) v1(99.48,61.98) v1(99.48,61.09) v1(100.18,20.94) v1(100.18,19.87) v1(100.18,18.8) v1(100.3,26.23) v1(100.3,25.34) v1(100.39,43.21) v1(100.39,42.32) v1(100.56,61.98) v1(100.56,61.09)
24V_DOWN_LAMP: length 10.3
  Top Layer w0.762: TP9.1 42.79,13.54 R46.1 44.1,16.51 F6.2
24V_UP_LAMP: length 6.2
  Top Layer w0.762: F5.2 50.01,73.48 R45.1
GND: length 180.8
  Top Layer w0.254: v1(113.03,35.04) 113.03,35.05 D25.2 ; D22.2 v1(7.75,54.03) ; TP40.1 111.85,81.65 U5.1 ; D26.2 v1(113.03,54.32) ; v1(113.03,4.4) 112.9,4.53 D24.2 ; D21.2 v1(7.11,33.2) ; D23.2 7.11,4.92 v1(7.11,4.92)
  Top Layer w0.508: v1(32.64,17.79) 32.64,17.03 RN4.3 ; v1(104.65,20.4) 104.39,20.66 C37.1 ; C46.1 105.33,35.91 104.17,35.91 ; U17.3 103.19,18.62 C37.1 ; TP41.1 104.9,79.02 v1(104.9,77.94) 105.62,77.94 TP42.1 ; 104.17,35.91 R83.1 ; 104.17,35.91 104.65,35.43 v1(104.65,35.01) ; C37.1 103.19,22.48 R61.2
  Top Layer w0.762: D18.1 v1(111.52,19.26) ; U8.3 20.95,65.55 C20.1 ; v1(18.29,57.49) 18.29,58.86 R26.2 R28.2 ; v1(58.09,33.94) 57.11,33.94 D15.1 53.66,33.81 R75.1 53.41,34.06 v1(49.85,34.06) ; v1(14.1,20.28) 15.42,20.28 R59.2 R57.2 ; D19.2 75.18,76.79 v1(73.28,74.89) ; C35.1 98.11,28.15 100.4,28.15 ; 100.65,45.3 99.17,45.3 98.86,45.61 C31.1 ; D16.1 102.79,32.34 v1(102.11,32.34) ; v1(74.54,70.7) 74.55,70.71 C27.1 ; v1(28.07,70.95) 27.98,71.04 RN3.2 RN3.1 ; 105.28,53.87 105.28,53.87 102.81,53.87 102.24,53.3 v1(102.24,52.64) 102.24,50.71 D17.1 102.81,49.05 v1(102.74,48.98) ; U18.3 17.81,17.44 17.81,15.62 17.19,15 14.61,15 ; v1(54.86,47.2) 55.44,46.63 C22.1 57.86,46.63 R32.1 62.79,46.45 D13.1 63.31,46.89 v1(64.13,46.06) ; 32.68,17.01 RN4.2 RN4.1 ; R83.1 102.24,35.14 102.24,32.93 ; 100.65,64.5 98.37,64.5 C29.1 ; U9.3 22.61,44.47 C23.1 ; R87.1 116.96,15.63 C48.1 v1(118.24,15.58) ; R40.1 68.51,34.89 D12.1 68.94,34.87 v1(68.2,34.12) ; R40.1 65.61,34.94 C25.1 63.88,34.09 v1(63.98,33.99) ; R40.1 v1(65.66,34) ; C33.1 22.92,25.74 U15.3 ; C15.2 v1(90.3,62.25)
  Bottom Layer w0.254: U7.74 93.11,42.04 C10.2 ; U7.10 75.38,45.97 76.14,45.97 77.36,44.75 U7.99 77.36,37.98 ; v1(64.85,46.65) 65.27,46.22 ; C12.1 71.44,54.31 C11.1 69.66,50.9 ; 76.35,56.85 77.29,55.92 77.29,55.83 77.36,55.75 U7.27 ; U7.20 75.24,51.11 74.39,51.11 73.78,51.72 70.48,51.72 69.66,50.9 ; 69.66,50.9 C6.2
  Bottom Layer w0.508: v1(73.75,60.45) 72.44,59.14 72.44,57.79 73.38,56.85 C5.2 ; C16.1 70.42,49.87 v1(68.31,49.87) v1(66.98,49.87) v1(65.6,49.87) 65.35,49.87 v1(64.85,49.36) v1(64.85,48.01) v1(64.85,46.65) 64.85,45.47 65.55,44.77 66.93,44.77 67,44.84 68.19,44.84 v1(68.31,44.72) 68.56,44.98 C19.1 ; v1(67.94,51.95) 68.3,51.95 68.5,52.15 69.28,52.15 C11.1 ; X2.2 65.27,46.22 ; X2.4 69.51,47.92 v1(69.6,47.84) ; 70.87,43.33 70.74,43.2 67.94,43.2 67.44,42.69 v1(67.44,41.84) v1(67.44,40.79) 67.44,39.86 67.81,39.49 v1(68.63,39.49) 69.03,39.09 70.53,39.09 C3.1
  Bottom Layer w0.762: C9.2 92.71,54.95 93.83,56.07 v1(93.83,57.21) 91.21,57.21 91.11,57.11 C13.1 ; C14.1 v1(94.43,42.1) C10.2 ; v1(78.61,37.62) 77.75,37.62 77.7,37.68 77.66,37.68 C8.2 ; C7.2 72.76,44.98 C19.1
  vias: v1(3.1,82.84) v1(3.1,77.76) v1(3.1,72.68) v1(3.1,52.36) v1(3.1,42.2) v1(3.1,32.04) v1(3.1,21.88) v1(3.1,16.8) v1(3.1,11.72) v1(3.1,6.64) v1(8.18,87.92) v1(8.18,77.76) v1(8.18,57.44) v1(8.18,52.36) v1(8.18,47.28) v1(8.18,37.12) v1(8.18,16.8) v1(13.26,87.92) v1(13.26,77.76) v1(13.26,72.68) v1(13.26,6.64) v1(13.26,1.56) v1(18.34,87.92) v1(18.34,82.84) v1(18.34,67.6) v1(18.34,52.36) v1(18.34,47.28) v1(18.34,37.12) v1(18.34,1.56) v1(23.42,87.92) v1(23.42,72.68) v1(23.42,16.8) v1(23.42,6.64) v1(23.42,1.56) v1(28.5,87.92) v1(28.5,21.88) v1(28.5,11.72) v1(28.5,6.64) v1(28.5,1.56) v1(33.58,82.84) v1(33.58,77.76) v1(33.58,57.44) v1(33.58,52.36) v1(33.58,42.2) v1(33.58,1.56) v1(38.66,87.92) v1(38.66,82.84) v1(38.66,57.44) v1(38.66,52.36) v1(38.66,42.2) v1(38.66,37.12) v1(38.66,26.96) v1(38.66,16.8) v1(38.66,11.72) v1(38.66,6.64) v1(43.74,87.92) v1(43.74,82.84) v1(43.74,77.76) v1(43.74,62.52) v1(43.74,57.44) v1(43.74,42.2) v1(43.74,37.12) v1(43.74,11.72) v1(43.74,6.64) v1(48.82,82.84) v1(48.82,42.2) v1(48.82,37.12) v1(48.82,6.64) v1(48.82,1.56) v1(53.9,82.84) v1(53.9,77.76) v1(53.9,16.8) v1(53.9,11.72) v1(53.9,6.64) v1(53.9,1.56) v1(58.98,87.92) v1(58.98,82.84) v1(58.98,11.72) v1(58.98,1.56) v1(64.06,82.84) v1(64.06,67.6) v1(64.06,62.52) v1(64.06,6.64) v1(64.06,1.56) v1(64.9,45.3) v1(65.55,44.72) v1(66.93,44.72) v1(67.44,39.74) v1(68.58,43.14) v1(69.14,87.92) v1(69.14,82.84) v1(69.14,72.68) v1(74.22,87.92) v1(74.22,82.84) v1(79.3,87.92) v1(79.3,82.84) v1(79.3,72.68) v1(79.3,52.36) v1(84.38,87.92) v1(84.38,82.84) v1(84.38,77.76) v1(84.38,42.2) v1(84.38,6.64) v1(84.38,1.56) v1(89.46,87.92) v1(89.46,82.84) v1(89.46,6.64) v1(89.46,1.56) v1(94.54,87.92) v1(94.54,82.84) v1(94.54,47.28) v1(94.54,11.72) v1(94.54,6.64) v1(94.54,1.56) v1(99.62,87.92) v1(99.62,82.84) v1(99.62,77.76) v1(99.62,72.68) v1(99.62,6.64) v1(104.7,82.84) v1(104.7,72.68) v1(104.7,21.88) v1(104.7,1.56) v1(109.78,87.92) v1(109.78,21.88) v1(109.78,6.64) v1(109.78,1.56) v1(114.86,82.84) v1(114.86,77.76) v1(114.86,72.68) v1(114.86,67.6) v1(114.86,62.52) v1(114.86,52.36) v1(114.86,47.28) v1(114.86,42.2) v1(114.86,32.04) v1(114.86,1.56)
VBAT: length 7.2
  Bottom Layer w0.254: U7.6 76.06,44.04 76.13,43.97 76.14,43.97 76.39,43.72 76.39,43.71 76.84,43.26 76.84,41.74 75.95,40.85 75.19,40.85 R24.2
VDDA: length 267.4
  Top Layer w0.762: D12.2 68.94,38.12 v1(68.7,38.36) ; R72.2 v1(12.19,7.83) ; D16.2 106.03,32.36 v1(106.04,32.34) 110.12,32.34 R80.2 ; v1(109.6,16.09) 111.46,16.09 D18.2 ; v1(64.11,48.78) 64.1,48.79 D13.2 ; R84.2 109.86,3.76 v1(109.85,3.77) ; v1(58.08,35.65) 58.03,35.7 D15.2 ; R76.2 108.22,50.12 v1(106.04,50.12) 106.03,50.14 D17.2 ; R37.2 v1(12.32,36.03) ; R29.2 v1(13.33,57.11)
  VCC w0.762: v1(40.89,43.39) 48.64,35.65 v1(58.08,35.65) 58.08,35.99 64.01,41.91 64.01,42.28 ; v1(18.54,35.14) 13.21,35.14 12.7,35.64 ; 12.7,35.64 v1(12.32,36.03) 13.08,36.79 13.08,56.85 v1(13.33,57.11) ; 12.7,35.64 12.7,15.45 13.46,14.69 13.46,9.1 v1(12.19,7.83) ; v1(72.29,52.41) 70.73,50.85 65.15,50.85 63.88,49.58 63.88,49.01 v1(64.11,48.78) 63.25,47.91 63.25,43.04 64.01,42.28 ; 64.01,42.28 66.6,39.69 66.6,39.39 67.55,38.44 68.63,38.44 v1(68.7,38.36) 68.8,38.46 91.19,38.46 v1(92,37.65) ; v1(106.04,50.12) 110.14,46.03 110.14,36.44 v1(106.04,32.34) 108.59,29.8 108.59,17.1 v1(109.6,16.09) 112.27,16.09 114.17,14.18 114.17,8.09 v1(109.85,3.77)
  Bottom Layer w0.254: U7.21 U7.22 75.26,52.09 71.51,52.09 71.19,52.41
  Bottom Layer w0.762: v1(18.54,35.14) 29.21,35.14 37.47,43.39 v1(40.89,43.39) ; v1(92,37.65) 92.08,37.57 100.81,37.57 v1(106.04,32.34) ; C11.2 71.19,52.41 v1(72.29,52.41) 72.84,52.96 C12.2 72.84,55.57 L1.1
VIN_24_FUSED:
  vias: v1(74.39,15.46) v1(75.18,15.45) v1(75.18,14.6) v1(75.18,13.81) v1(75.18,12.92) v1(75.87,11.86) v1(75.87,10.37) v1(75.87,8.97) v1(81.41,16.47) v1(81.41,15.2) v1(81.53,17.48) v1(81.47,14.22) v1(82.5,16.47) v1(82.54,15.2) v1(82.56,17.48) v1(82.58,14.22) v1(91.08,15.72) v1(91.08,14.9) v1(91.08,13.89) v1(92.07,15.71) v1(92.07,14.87) v1(92.07,13.89)
VIN_24_RAW:
  vias: v1(67.06,12.3) v1(67.06,11.16) v1(67.06,10.05) v1(67.06,8.82) v1(67.56,7.7) v1(67.82,13.16) v1(68.7,13.16) v1(68.65,7.7) v1(69.62,7.7) v1(69.71,13.16) v1(70.68,7.7)
VIN_24_SW:
  vias: v1(35.05,25.23) v1(35.05,23.66) v1(35.05,21.75) v1(35.05,20.1) v1(36.88,25.23) v1(36.88,23.66) v1(36.88,21.75) v1(36.88,20.1) v1(38.74,25.1) v1(38.79,23.66) v1(38.79,21.75) v1(38.79,20.1) v1(40.69,25.1) v1(40.69,23.66) v1(40.69,21.75) v1(40.69,20.1) v1(42.64,25.1) v1(42.6,23.66) v1(42.6,21.75) v1(42.6,20.1) v1(45,25.1) v1(45.01,23.66) v1(45.01,21.75) v1(44.96,20.15) v1(46.91,23.66) v1(46.91,21.75) v1(46.86,20.15) v1(46.99,25.1) v1(48.82,25.1) v1(48.82,23.66) v1(48.77,21.8) v1(48.77,20.15) v1(50.04,65.87) v1(50.72,25.1) v1(50.72,23.66) v1(51.12,65.87) v1(52.18,65.87) v1(53.85,21.29) v1(53.9,20.1) v1(55.75,21.29) v1(55.8,20.1) v1(57.66,21.29) v1(57.71,20.1) v1(59.06,29.31) v1(59.06,28.42) v1(59.06,27.52) v1(59.32,54.33) v1(59.31,53.42) v1(59.56,21.29) v1(59.61,20.1) v1(60.09,29.29) v1(60.07,28.41) v1(60.07,27.52) v1(60.32,54.31) v1(60.32,53.42) v1(61.15,29.29) v1(61.15,28.41) v1(61.15,27.52) v1(61.4,54.31) v1(61.4,53.42) v1(61.47,21.29) v1(61.52,20.1) v1(62.23,29.29) v1(62.21,28.41) v1(62.23,27.52) v1(62.47,54.31) v1(62.48,53.42) v1(63.18,29.3) v1(63.18,28.41) v1(63.17,27.5) v1(64.01,25.61) v1(64.01,20.15) v1(64.06,24.04) v1(64.06,22.13) v1(65.91,25.61) v1(65.91,20.15) v1(65.96,24.04) v1(65.96,22.13) v1(67.82,25.61) v1(67.82,20.15) v1(67.87,24.04) v1(67.87,22.13) v1(69.72,25.61) v1(69.72,20.15) v1(69.77,24.04) v1(69.77,22.13) v1(71.63,25.61) v1(71.63,20.15) v1(71.68,24.04) v1(71.68,22.13) v1(73.53,20.28) v1(73.58,24.04) v1(73.58,22.13) v1(75.44,20.28) v1(75.49,24.04) v1(75.49,22.13) v1(80.01,25.48) v1(80.01,24.4) v1(80.01,23.26) v1(80.9,25.48) v1(80.9,24.4) v1(80.9,23.26) v1(82.04,25.48) v1(82.04,24.4) v1(82.04,23.26) v1(82.93,25.48) v1(82.93,24.4) v1(82.93,23.26)
BOOT0: length 40.1
  Top Layer w0.254: 87.25,73.29 86.25,72.29 86.25,58.35 86.97,57.63 86.97,55.68 83.82,52.53 v1(83.82,46.44)
  Top Layer w0.508: 87.25,73.29 87.25,75.01 87.51,75.27 R22.2
  Bottom Layer w0.254: v1(83.82,46.44) 79.86,42.48 U7.94
BOOT1: length 24
  Top Layer w0.254: 84.71,73.29 85.89,72.11 85.89,60.4 v1(85.52,60.03)
  Top Layer w0.508: R21.2 84.71,76.28 BOOT1.2 84.71,73.29
  Bottom Layer w0.254: v1(85.52,60.03) 85.06,59.57 83.53,59.57 83.22,59.26 83.22,57.56 82.97,57.31 82.97,57.28 82.43,56.74 82.43,56.26 82.38,56.22 82.38,55.11 U7.37
BUZZER: length 21.2
  Top Layer w0.254: R99.1 v1(73.53,65.23)
  Bottom Layer w0.254: v1(73.53,65.23) 73.79,64.98 80.78,64.98 82.51,63.25 82.51,57.95 81.13,56.57 79.86,56.57 79.38,56.1 79.38,55.67 79.43,55.62 79.43,55.16 U7.31
DBG_UART_RX: length 109.3
  Top Layer w0.254: U30.3 8.4,79.19 14.91,72.68 U33.2
  Bottom Layer w0.254: U7.48 87.86,56.49 87.12,57.23 87.12,72.61 78.1,81.62 29.72,81.62 20.78,72.68 U33.2
DBG_UART_TX: length 116.9
  Top Layer w0.254: U30.4 6.4,71.66 8.51,69.55 17.29,69.55 U33.1
  Bottom Layer w0.254: U33.1 18.74,70.14 29.6,81 77.71,81 86.74,71.97 86.74,57.1 87.36,56.48 U7.47
DOWN_PWM1: length 82.5
  Top Layer w0.254: v1(81.53,53.17) 81.53,53.04 78.18,49.69 78.18,41.94 67.51,31.28 36.78,31.28 30.81,25.31 30.81,16.52 31.17,16.16 32.19,16.16 32.42,15.93 32.42,15.61 RN4.6 RN2.3
  Bottom Layer w0.254: v1(81.53,53.17) 81.36,53.34 U7.35
DOWN_PWM2: length 87.3
  Top Layer w0.254: v1(82.55,53.3) 82.49,53.3 78.54,49.35 78.54,41.66 67.8,30.92 37.05,30.92 31.37,25.24 31.37,19.31 32.18,18.5 35.56,18.5 35.92,18.14 35.92,16.7 35.43,16.21 33.9,16.21 33.62,15.93 33.62,15.61 RN4.7 RN2.2
  Bottom Layer w0.254: v1(82.55,53.3) 81.86,53.99 U7.36
DOWN_PWM3: length 69.7
  Top Layer w0.254: v1(36.19,15.58) 36.03,15.41 RN4.8 RN2.1 ; v1(37.34,27.52) 40.39,30.56 67.94,30.56 73.15,35.77 80.95,35.77 v1(82.8,37.62)
  Bottom Layer w0.254: v1(37.34,27.52) 35.69,25.86 35.69,16.09 v1(36.19,15.58) ; U7.90 81.86,38.52 82.8,37.57
HOME_EXT: length 17.2
  Top Layer w0.254: R92.1 77.47,82.51 76.33,83.65 73.28,83.65 72.45,82.83 CN15.5 70.36,78.94 D19.1
HOME_KEY: length 43.5
  Top Layer w0.254: 77.38,65.26 77.25,65.38 SW1.2 ; SW1.2 75.48,74.36 C27.2 74.48,73.35 R43.1 ; SW1.2 77.25,76.2 R92.2 ; SW1.2 78.84,74.36 v1(78.87,74.38)
  Bottom Layer w0.254: v1(78.87,74.38) 83.44,74.38 86.36,71.46 86.36,56.98 86.86,56.48 U7.46
LED_ACT: length 38.4
  Top Layer w0.254: v1(63.88,75.27) 61.62,75.27 LED2.1
  Bottom Layer w0.254: v1(63.88,75.27) 63.98,75.17 63.98,71.8 67.37,68.41 67.69,68.41 70.23,65.87 80.39,65.87 82.87,63.39 82.87,57.72 82.62,57.47 82.62,57.43 81.41,56.22 80.23,56.22 79.93,55.92 79.93,55.16 U7.32
LED_COMM: length 35.6
  Top Layer w0.254: v1(63.37,73.11) 63.2,73.28 LED3.1
  Bottom Layer w0.254: U7.30 78.86,56.08 79.89,57.11 81.15,57.11 82.15,58.11 82.15,63.02 80.57,64.6 70.68,64.6 63.37,71.91 v1(63.37,73.11)
LED_ERR: length 40
  Top Layer w0.254: LED1.1 61.62,77.23 64.59,77.23 65.02,76.79 65.02,70.75 65.28,70.49 69.46,70.49 74.78,65.18 74.78,63.86 75.56,63.08 81.85,63.08 82.66,62.26 82.66,59.83 83.75,58.74 v1(83.99,58.74)
  Bottom Layer w0.254: U7.38 82.79,55.16 82.79,55.94 82.78,55.95 82.78,56.07 82.8,56.09 82.78,56.11 82.78,56.59 83.33,57.13 83.33,57.16 83.99,57.83 v1(83.99,58.74)
LED_STATE: length 33.6
  Top Layer w0.254: U4.1 61.64,71.33 v1(62.87,71.33)
  Bottom Layer w0.254: v1(62.87,71.33) 63.37,71.33 69.47,65.23 69.54,65.23 70.53,64.24 80.42,64.24 81.79,62.88 81.79,58.25 81.03,57.49 79.74,57.49 78.43,56.18 78.43,55.16 U7.29
LINUX_PWR_OD: length 21.3
  Top Layer w0.254: Q10.3 102.27,79.02 TP32.1 104.35,81.77 U5.4 105.97,83.7 107.82,85.56 U36.4
LINUX_PWR_PULSE: length 24.5
  Top Layer w0.254: R41.1 100.71,72.59 v1(100.71,70.7)
  Bottom Layer w0.254: v1(100.71,70.7) 96.25,66.24 96.25,57.47 92.32,53.54 U7.51
LINUX_UART_RX: length 42.3
  Top Layer w0.254: v1(92.33,50.12) 91.82,49.61 v1(91.82,44.15) ; v1(106.17,74.51) 106.17,76.56 TP31.1 107.5,76.6 R94.1
  Bottom Layer w0.254: v1(91.82,44.15) 91.43,44.54 U7.69 ; v1(92.33,50.12) 96.77,54.57 96.77,65.74 105.54,74.51 v1(106.17,74.51)
LINUX_UART_TX: length 52.5
  Top Layer w0.254: v1(113.28,76.28) 112.6,76.97 TP30.1 111.84,77.05 R93.1 ; v1(92.5,44.63) 92.5,49.15 v1(93.09,49.74)
  Bottom Layer w0.254: v1(113.28,76.28) 113.28,70.57 112.27,69.55 101.47,69.55 97.36,65.44 97.36,54.01 v1(93.09,49.74) ; U7.68 90.43,45.02 92.11,45.02 v1(92.5,44.63)
M1_BI_PWM: length 21.3
  Top Layer w0.254: R25.1 62.87,50.63 64.77,52.53 71.59,52.53 74.89,55.84 v1(75.82,55.84)
  Bottom Layer w0.254: v1(75.82,55.84) 76.11,55.84 U7.26
M1_FI_PWM: length 20.9
  Top Layer w0.254: R27.1 58.34,49.92 62.66,49.92 63.97,51.23 72.36,51.23 73.27,52.14 73.27,53.67 73.91,54.31 v1(75.31,54.31)
  Bottom Layer w0.254: 75.31,53.54 v1(75.31,54.31)
